# Altium schematic sheet 425AK01A_S07.SchDoc
size A3; DocumentNumber: 7; SheetNumber: 7; SheetTotal: 10; PageSetup: Record=PageOptions|CenterHorizontal=True|CenterVertical=True|PrintScale=1.01|XCorrection=1.00|YCorrection=1.00|PrintKind=1|BorderSize=5000000|LeftOffset=0|BottomOffset=0|Orientation=2|PaperLength=1000|PaperWidth=1000|Scale=100|PaperSource=15|PrintQuality=600|MediaType=1|DitherType=10|PaperKind=A3|PrintScaleMode=1; 00_Drawn: RJG; 00_Date: 8APR2022; 00_Checked: SR; 00_Approved: GN; 00_Line1: VCXO/PLL PATH B
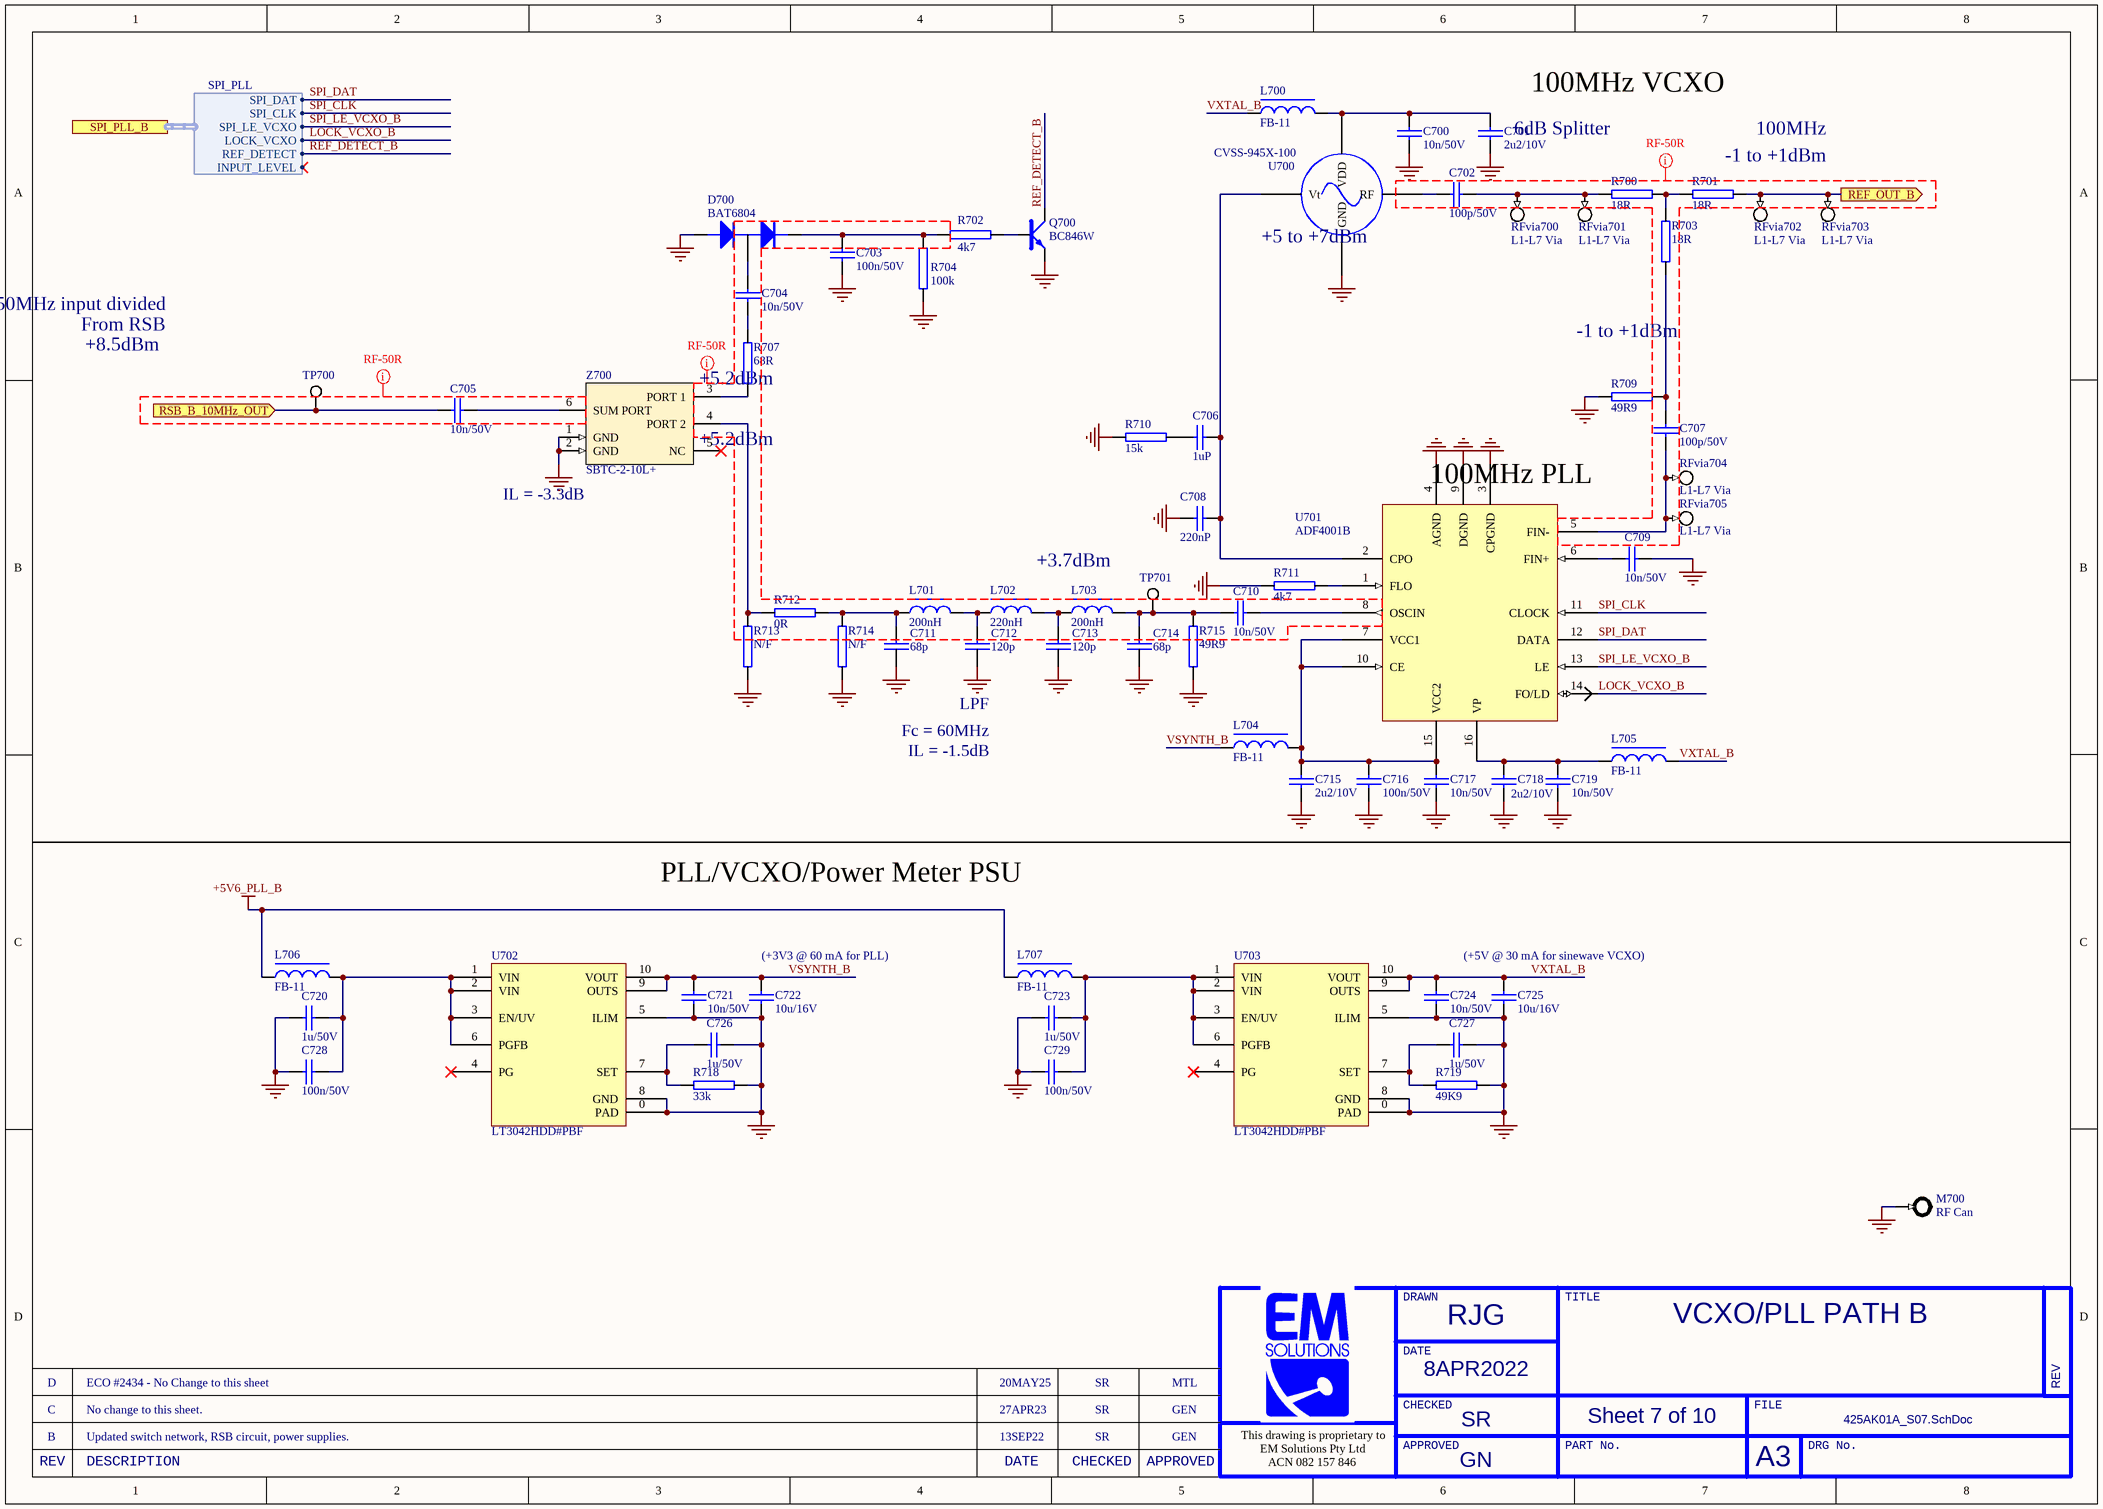
[diagram p0: 425AK01A_S07.SchDoc]

## Parts
C700  10n/50V  [0402C]
C701  2u2/10V  [0603C]
C702  100p/50V  [0402C]
C703  100n/50V  [0402C]
C704  10n/50V  [0402C]
C705  10n/50V  [0402C]
C706  1uP  [1210C]
C707  100p/50V  [0402C]
C708  220nP  [1206C]
C709  10n/50V  [0402C]
C710  10n/50V  [0402C]
C711  68p  [0402C]
C712  120p  [0402C]
C713  120p  [0402C]
C714  68p  [0402C]
C715  2u2/10V  [0603C]
C716  100n/50V  [0402C]
C717  10n/50V  [0402C]
C718  2u2/10V  [0603C]
C719  10n/50V  [0402C]
C720  1u/50V  [0603C]
C721  10n/50V  [0402C]
C722  10u/16V  [0805C]
C723  1u/50V  [0603C]
C724  10n/50V  [0402C]
C725  10u/16V  [0805C]
C726  1u/50V  [0603C]
C727  1u/50V  [0603C]
C728  100n/50V  [0402C]
C729  100n/50V  [0402C]
D700  BAT6804  [SOT-23DAP]
L700  FB-11  [0402L]
L701  200nH  [0402L]
L702  220nH  [0402L]
L703  200nH  [0402L]
L704  FB-11  [0402L]
L705  FB-11  [0402L]
L706  FB-11  [0402L]
L707  FB-11  [0402L]
M700  RF Can  [Can_38x25.4x6mm]
Q700  BC846W  [SOT-323BJT]
R700  18R  [0402]
R701  18R  [0402]
R702  4k7  [0402]
R703  18R  [0402]
R704  100k  [0402]
R707  68R  [0402]
R709  49R9  [0402]
R710  15k  [0402]
R711  4k7  [0402]
R712  0R  [0402]
R713  N/F  [0402]
R714  N/F  [0402]
R715  49R9  [0402]
R718  33k  [0402]
R719  49K9  [0402]
RFvia700  L1-L7 Via  [RFvia_L1-L7]  (no BOM)
RFvia701  L1-L7 Via  [RFvia_L1-L7]  (no BOM)
RFvia702  L1-L7 Via  [RFvia_L1-L7]  (no BOM)
RFvia703  L1-L7 Via  [RFvia_L1-L7]  (no BOM)
RFvia704  L1-L7 Via  [RFvia_L1-L7]  (no BOM)
RFvia705  L1-L7 Via  [RFvia_L1-L7]  (no BOM)
TP700  Pad  [Testpoint-0.5mm-SMT-withPaste]  (value not drawn)  (no BOM)
TP701  Pad  [Testpoint-0.5mm-SMT-withPaste]  (value not drawn)  (no BOM)
U700  CVSS-945X-100  [CVHD-950]
U701  ADF4001B  [TSSOP-16]
U702  LT3042HDD#PBF  [DFN50P300X300X80_HS-11N]
U703  LT3042HDD#PBF  [DFN50P300X300X80_HS-11N]
Z700  SBTC-2-10L+  [SBTC-2-10L+]

## Ports
REF_OUT_B (out), RSB_B_10MHz_OUT (in), SPI_PLL_B (harness SPI_PLL)

## Harnesses
SPI_PLL: SPI_LE_VCXO, SPI_CLK, SPI_DAT, REF_DETECT, LOCK_VCXO, INPUT_LEVEL

## Nets
+5V6_PLL_B: L706.2 L707.2
GND: C700.2 C701.2 C703.1 C708.1 C709.2 C711.1 C712.1 C713.1 C714.1 C715.2 C716.2 C717.2 C718.2 C719.2 C720.1 C721.1 C722.2 C723.1 C724.1 C725.2 C726.2 C727.2 C728.2 C729.2 D700.A M700.0 Q700.E R704.1 R709.2 R710.2 R711.1 R713.1 R714.1 R715.1 R718.1 R719.1 U700.2(GND) U701.3(CPGND) U701.4(AGND) U701.9(DGND) U702.0(PAD) U702.5(ILIM) U702.8(GND) U703.0(PAD) U703.5(ILIM) U703.8(GND) Z700.1(GND) Z700.2(GND)
LOCK_VCXO_B: U701.14(FO/LD) ; port SPI_PLL_B.LOCK_VCXO
REF_DETECT_B: Q700.C ; port SPI_PLL_B.REF_DETECT
REF_OUT_B: R701.2 RFvia702.1 RFvia703.1 ; port REF_OUT_B
RSB_B_10MHz_OUT: C705.1 TP700.1 ; port RSB_B_10MHz_OUT
SPI_CLK: U701.11(CLOCK) ; port SPI_PLL_B.SPI_CLK
SPI_DAT: U701.12(DATA) ; port SPI_PLL_B.SPI_DAT
SPI_LE_VCXO_B: U701.13(LE) ; port SPI_PLL_B.SPI_LE_VCXO
VSYNTH_B: C721.2 C722.1 L704.1 U702.9(OUTS) U702.10(VOUT)
VXTAL_B: C724.2 C725.1 L700.1 L705.2 U703.9(OUTS) U703.10(VOUT)
NetC700_1: C700.1 C701.1 L700.2 U700.4(VDD)
NetC702_1: C702.1 R700.1 RFvia700.1 RFvia701.1
NetC702_2: C702.2 U700.3(RF)
NetC703_2: C703.2 D700.K R702.2 R704.2
NetC704_1: C704.1 R707.2
NetC704_2: C704.2 D700.KA
NetC705_2: C705.2 Z700.6(SUM_PORT)
NetC706_1: C706.1 C708.2 U700.1(Vt) U701.2(CPO)
NetC706_2: C706.2 R710.1
NetC707_1: C707.1 R703.2 R709.1
NetC707_2: C707.2 RFvia704.1 RFvia705.1 U701.5(FIN-)
NetC709_1: C709.1 U701.6(FIN+)
NetC710_1: C710.1 C714.2 L703.2 R715.2 TP701.1
NetC710_2: C710.2 U701.8(OSCIN)
NetC711_2: C711.2 L701.1 R712.1 R714.2
NetC712_2: C712.2 L701.2 L702.1
NetC713_2: C713.2 L702.2 L703.1
NetC715_1: C715.1 C716.1 C717.1 L704.2 U701.7(VCC1) U701.10(CE) U701.15(VCC2)
NetC718_1: C718.1 C719.1 L705.1 U701.16(VP)
NetC720_2: C720.2 C728.1 L706.1 U702.1(VIN) U702.2(VIN) U702.3(EN/UV) U702.6(PGFB)
NetC723_2: C723.2 C729.1 L707.1 U703.1(VIN) U703.2(VIN) U703.3(EN/UV) U703.6(PGFB)
NetC726_1: C726.1 R718.2 U702.7(SET)
NetC727_1: C727.1 R719.2 U703.7(SET)
NetQ700_B: Q700.B R702.1
NetR700_2: R700.2 R701.1 R703.1
NetR707_1: R707.1 Z700.3(PORT_1)
NetR711_2: R711.2 U701.1(FLO)
NetR712_2: R712.2 R713.2 Z700.4(PORT_2)

Not connected (* = marked no-connect by the designer): U702 4(PG)*; U703 4(PG)*; Z700 5(NC)*

## Layout directives
net class RF-50R: (no net found under the mark)

## Notes on the sheet
- 100MHz VCXO
- 6dB Splitter
- 100MHz
- (near RFvia703) -1 to +1dBm
- (near U700) +5 to +7dBm
- 10MHz from 10MHz input or 50MHz input divided
- +8.5dBm
- From RSB
- -1 to +1dBm
- (near R707) +5.2dBm
- +5.2dBm
- (near Z700) IL = -3.3dB
- (near U701) 100MHz PLL
- +3.7dBm
- LPF
- Fc = 60MHz
- IL = -1.5dB
- PLL/VCXO/Power Meter PSU
- (near C722) (+3V3 @ 60 mA for PLL)
- (+5V @ 30 mA for sinewave VCXO)
- D
- ECO #2434 - No Change to this sheet
- 20MAY25
- SR
- MTL
- B
- C
- Updated switch network, RSB circuit, power supplies.
- No change to this sheet.
- 13SEP22
- 27APR23
- GEN
- DRAWN
- TITLE
- DATE
- REV
- This drawing is proprietary to
- EM Solutions Pty Ltd
- APPROVED
- CHECKED
- PART No.
- FILE
- A3
- DRG No.
- DESCRIPTION
- ACN 082 157 846

## Library data of the parts
C700 C704 C709 C710 C717 C719 C721 C724 = 41-010N-12: Capacitor, 0402, 10n X7R 10% 50V Ceramic, NiSn; MANUFACTURER: MURATA; ID: 2217; MODELNAME: GCM155R71H103KA55D; Part Number: 41-010N-12; ItemID: 41-010N-12
C701 C715 C718 = 41-02U2-06: Capacitor, 0603, 2u2 X7R 10% 10V Ceramic, NiSn; MANUFACTURER: MURATA; ID: 2333; MODELNAME: GRM188R71A225KE15D; Part Number: 41-02U2-06; ItemID: 41-02U2-06
C702 = 41-100P-11: Capacitor, 0402, 100p NPO 5% 50V Ceramic, AEC-Q200; MANUFACTURER: TDK; MODELNAME: CGA2B2C0G1H101J050BA; ID: 2448; Part Number: 41-100P-11; ItemID: 41-100P-11
C703 C716 C728 C729 = 41-100N-13: Capacitor, 0402, 100n, X7R, 10% 50V, Ceramic; MANUFACTURER: MURATA; ID: 2441; MODELNAME: GRM155R71H104KE14J; Part Number: 41-100N-13; ItemID: 41-100N-13
C705 = 41-010N-12: Capacitor, 0402, 10n X7R 10% 50V Ceramic, NiSn; MANUFACTURER: MURATA; MODELNAME: GCM155R71H103KA55D; ID: 2217; Part Number: 41-010N-12; ItemID: 41-010N-12
C706 = 41-01U0-05: Capacitor, 1210, 1u PPS 20% 16V Plastic Film; MANUFACTURER: PANASONIC; ID: 2286; MODELNAME: ECPU1C105MA5; Part Number: 41-01U0-05; ItemID: 41-01U0-05
C707 = 41-100P-11: Capacitor, 0402, 100p NPO 5% 50V Ceramic, AEC-Q200; MANUFACTURER: TDK; ID: 2448; MODELNAME: CGA2B2C0G1H101J050BA; Part Number: 41-100P-11; ItemID: 41-100P-11
C708 = 41-220N-05: Capacitor, 1206, 220n PPS 20% 16V Plastic Film; MANUFACTURER: PANASONIC; ID: 2468; MODELNAME: ECPU1C224MA5; Part Number: 41-220N-05; ItemID: 41-220N-05
C711 C714 = 41-068P-08: Capacitor, 0402, 68p; Part Number: 41-068P-08
C712 C713 = 41-120P-05: Capacitor, 0402, 120p NPO; Part Number: 41-120P-05
C720 C723 C726 C727 = 41-01U0-06: Capacitor, 0603, 1u X7R 10% 50V Ceramic, NiSn; MANUFACTURER: TAIYOYUDEN; MODELNAME: UMK107AB7105KA; ID: 2287; Part Number: 41-01U0-06; ItemID: 41-01U0-06
C722 C725 = 41-010U-08: Capacitor, 0805, 10u X7R 10% 16V Ceramic, NiSn; MANUFACTURER: SAMSUNG; ID: 2232; MODELNAME: CL21B106KOQNNNE; Part Number: 41-010U-08; ItemID: 41-010U-08
D700 = 60-BAT68-04: *Diode, Schottky, Series Pair, 8V 130mA, SOT-23-3; MANUFACTURER: INFINEON; ID: 3625; MODELNAME: BAT6804E6327HTSA1; Part Number: 60-BAT68-04; ItemID: 60-BAT68-04
L700 L704 L705 = 46-B-11: Solid Inductor, 600ohm@100MHz, DCR=0.52, 0.3A, 0402 size; MANUFACTURER: TDK; ID: 3256; MODELNAME: MMZ1005S601C; Part Number: 46-B-11; ItemID: 46-B-11
L701 L703 = 46-200N-04: Inductor, Chip, 200nH, 0402; Part Number: 46-200N-04
L702 = 46-220N-05: Inductor, Chip, 220nH, 0402; Part Number: 46-220N-05
L706 L707 = 46-B-11: Solid Inductor, 600ohm@100MHz, DCR=0.52, 0.3A, 0402 size; MANUFACTURER: TDK; MODELNAME: MMZ1005S601C; ID: 3256; Part Number: 46-B-11; ItemID: 46-B-11
M700 = Can-RF: Part Number: 11-0256
Q700 = 62-BC846-01: Transistor, NPN Si, GenPur 65V 100mA, SOT-323; MANUFACTURER: TAIWAN SEMI; ID: 3683; MODELNAME: BC846CW RF; Part Number: 62-BC846-01; ItemID: 62-BC846-01
R700 R701 R703 = 44-018R-10: Resistor, 0402, 18R 1% 0.063W; MANUFACTURER: GENERIC; ID: 2594; Part Number: 44-018R-10; ItemID: 44-018R-10; MODELNAME: GENERIC
R702 R711 = 44-04K7-10: Resistor, 0402, 4k7 1% 0.063W; MANUFACTURER: PHILIPS; ID: 2794; MODELNAME: ERJ-2RKF4701X; Part Number: 44-04K7-10; ItemID: 44-04K7-10
R704 = 44-100K-10: Resistor, 0402, 100k 1% 0.063W; MANUFACTURER: PHILIPS; ID: 2931; MODELNAME: RC32H; Part Number: 44-100K-10; ItemID: 44-100K-10
R707 = 44-068R-10: Resistor, 0402, 68R 1% 0.063W; MANUFACTURER: PHILIPS; MODELNAME: RC32H; ID: 2849; Part Number: 44-068R-10; ItemID: 44-068R-10
R709 R715 = 44-049R9-10: Resistor, 0402, 49R9 1% 0.063W; MANUFACTURER: YAGEO; ID: 2787; MODELNAME: RC0402FR-0749R9L; Part Number: 44-049R9-10; ItemID: 44-049R9-10
R710 = 44-015K-10: Resistor, 0402, 15k 1% 0.063W; MANUFACTURER: PHILIPS; MODELNAME: RC32H; ID: 2575; Part Number: 44-015K-10; ItemID: 44-015K-10
R712 = 44-000R-10: Resistor, 0402, 0R 1% 0.063W; MANUFACTURER: GENERIC; ID: 2538; Part Number: 44-000R-10; ItemID: 44-000R-10; MODELNAME: GENERIC
R713 R714 = 44-N/F-10: Resistor, 0402, SOT, Not Fitted; ID: 3111; Part Number: 44-N/F-10; ItemID: 44-N/F-10
R718 = 44-033K-10: Resistor, 0402, 33k 1% 0.063W; MANUFACTURER: PHILIPS; MODELNAME: RC32H; ID: 2720; Part Number: 44-033K-10; ItemID: 44-033K-10
R719 = 44-49K9-01: Resistor, 0402, 49.9K, 1%, 0.1W, ThickFilm, AEC-Q200; MANUFACTURER: PANASONIC; MODELNAME: ERJ-2RKF4992X; ID: 3061; Part Number: 44-49K9-01; ItemID: 44-49K9-01
RFvia700-RFvia705 = RFvia_L1-L7: RF Via from layer 1 to layer 7, on an 8-layer board.; Rule: UNIONINDEX=0|RULEKIND=PlaneClearance|NETSCOPE=AnyNet|LAYERKIND=SameLayer|NAME=Schematic Power Plane Clearance|CLEARANCE=13.7795mil|UNIT=Imperial
TP700 TP701 = Pad: Pad that can be a test point or a hot via
U700 = 35-0223: VCXO, 100.00MHz, Sine 5V, SMD; MANUFACTURER: CRYSTEK; ID: 2098; Part Number: 35-0223; ItemID: 35-0223; MODELNAME: CVSS-945X-100
U701 = 54-4001-01: PLL Clock Gen, 200MHz, Serial TSSOP-16; MANUFACTURER: ANLG DEV; ID: 3488; Part Number: 54-4001-01; ItemID: 54-4001-01; MODELNAME: ADF4001BRUZ
U702 U703 = 52-3042-01: Volt Regulator, Vin=1.8-20V, Vin=0-15V, 200mA, Low Noise, -40to+125C; MANUFACTURER: ANLG DEV; MODELNAME: LT3042IDD#PBF; ID: 3361; Part Number: 52-3042-01; ItemID: 52-3042-01
Z700 = 33-0055: Divider/Combiner, 2 Way, 0 deg, 10 -1000MHz, Tx Line Tranformer; MANUFACTURER: MINICCTS; ID: 2075; Part Number: 33-0055; MODELNAME: SBTC-2-10L+; ItemID: 33-0055